# Altium schematic sheet raspberry_interface.SchDoc
size A
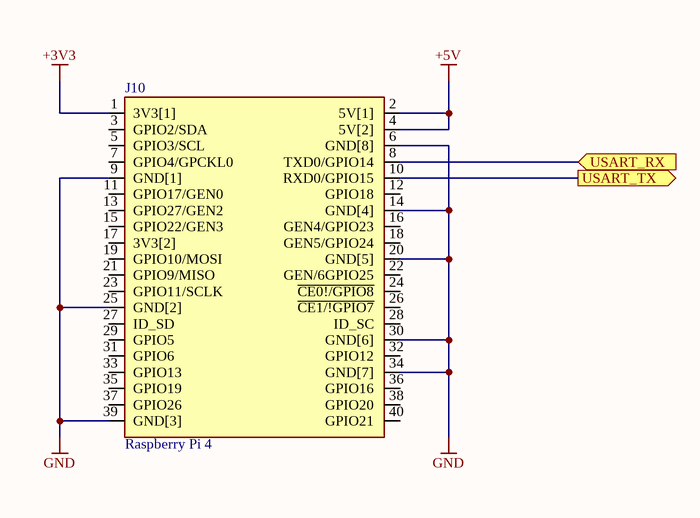
[diagram p0: raspberry_interface.SchDoc]

## Parts
J10  Raspberry Pi 4  [40P_HEADER]

## Ports
USART_RX (in), USART_TX (out)

## Nets
+3V3: J10.1(3V3[1])
+5V: J10.2(5V[1]) J10.4(5V[2])
GND: J10.6(GND[8]) J10.9(GND[1]) J10.14(GND[4]) J10.20(GND[5]) J10.25(GND[2]) J10.30(GND[6]) J10.34(GND[7]) J10.39(GND[3])
USART_RX: J10.8(TXD0/GPIO14) ; port USART_RX
USART_TX: J10.10(RXD0/GPIO15) ; port USART_TX

Not connected (* = marked no-connect by the designer): J10 3(GPIO2/SDA) 5(GPIO3/SCL) 7(GPIO4/GPCKL0) 11(GPIO17/GEN0) 12(GPIO18) 13(GPIO27/GEN2) 15(GPIO22/GEN3) 16(GEN4/GPIO23) 17(3V3[2]) 18(GEN5/GPIO24) 19(GPIO10/MOSI) 21(GPIO9/MISO) 22(GEN/6GPIO25) 23(GPIO11/SCLK) 24(~{CE0!/GPIO8}) 26(~{CE1/!GPIO7}) 27(ID_SD) 28(ID_SC) 29(GPIO5) 31(GPIO6) 32(GPIO12) 33(GPIO13) 35(GPIO19) 36(GPIO16) 37(GPIO26) 38(GPIO20) 40(GPIO21)

## Library data of the parts
J10 = RASPBERRY_PI4: Raspberry Pi 4 with Headers_; MP: ADA3708; Availability: Unavailable; Package: None; MF: Raspberry Pi; Value: *; Price: None; SnapEDA_Link: https://www.snapeda.com/parts/ADA3708/Raspberry%20Pi/view-part/2770118/?ref=snap